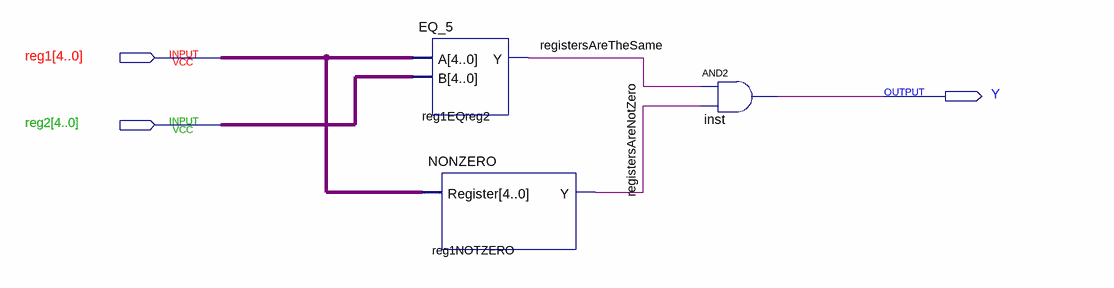
[diagram p0: schematic sheet]
// Quartus schematic REGCheck.bdf as structural Verilog: 3 symbols, 3 pins
module REGCheck (
  input  [4:0] reg1,
  input  [4:0] reg2,
  output Y
);

  wire registersAreNotZero, registersAreTheSame;

  EQ_5 reg1EQreg2 (.A(reg1), .B(reg2), .Y(registersAreTheSame));
  NONZERO reg1NOTZERO (.Register(reg1), .Y(registersAreNotZero));
  and inst (Y, registersAreTheSame, registersAreNotZero);
endmodule
